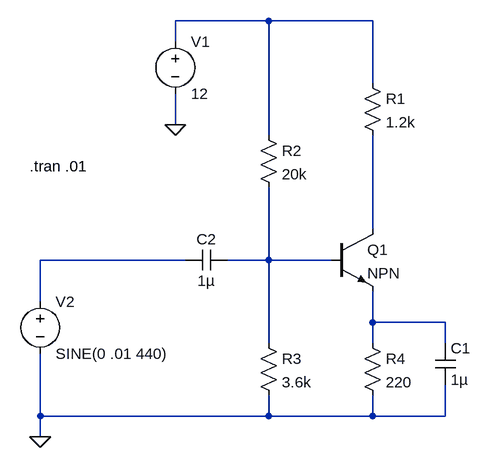
[diagram p0: schematic CommonEmitterAmplifier1.asc]
CommonEmitterAmplifier1.asc, the LTspice schematic file:
Version 4
SHEET 1 880 680
WIRE -64 -16 -208 -16
WIRE 96 -16 -64 -16
WIRE -208 16 -208 -16
WIRE 96 80 96 -16
WIRE -208 144 -208 96
WIRE -64 160 -64 -16
WIRE 96 304 96 160
WIRE -192 352 -416 352
WIRE -64 352 -64 240
WIRE -64 352 -128 352
WIRE 32 352 -64 352
WIRE -416 416 -416 352
WIRE 96 448 96 400
WIRE 208 448 96 448
WIRE -64 480 -64 352
WIRE 96 480 96 448
WIRE 208 480 208 448
WIRE -416 592 -416 496
WIRE -64 592 -64 560
WIRE -64 592 -416 592
WIRE 96 592 96 560
WIRE 96 592 -64 592
WIRE 208 592 208 544
WIRE 208 592 96 592
WIRE -416 624 -416 592
FLAG -208 144 0
FLAG -416 624 0
SYMBOL voltage -208 0 R0
WINDOW 123 0 0 Left 0
WINDOW 39 0 0 Left 0
SYMATTR InstName V1
SYMATTR Value 12
SYMBOL voltage -416 400 R0
WINDOW 123 0 0 Left 0
WINDOW 39 0 0 Left 0
SYMATTR InstName V2
SYMATTR Value SINE(0 .01 440)
SYMBOL npn 32 304 R0
SYMATTR InstName Q1
SYMBOL res 80 64 R0
SYMATTR InstName R1
SYMATTR Value 1.2k
SYMBOL res -80 144 R0
SYMATTR InstName R2
SYMATTR Value 20k
SYMBOL res -80 464 R0
SYMATTR InstName R3
SYMATTR Value 3.6k
SYMBOL res 80 464 R0
SYMATTR InstName R4
SYMATTR Value 220
SYMBOL cap 192 480 R0
SYMATTR InstName C1
SYMATTR Value 1µ
SYMBOL cap -128 336 R90
WINDOW 0 0 32 VBottom 2
WINDOW 3 32 32 VTop 2
SYMATTR InstName C2
SYMATTR Value 1µ
TEXT -432 208 Left 2 !.tran .01

The netlist it stands for:
* CommonEmitterAmplifier1.asc
V1 N001 0 12
V2 N003 0 SINE(0 .01 440)
Q1 N002 N004 N005 0 NPN
R1 N001 N002 1.2k
R2 N001 N004 20k
R3 N004 0 3.6k
R4 N005 0 220
C1 N005 0 1µ
C2 N004 N003 1µ
.model NPN NPN
.model PNP PNP
.lib standard.bjt
.tran .01
.backanno
.end